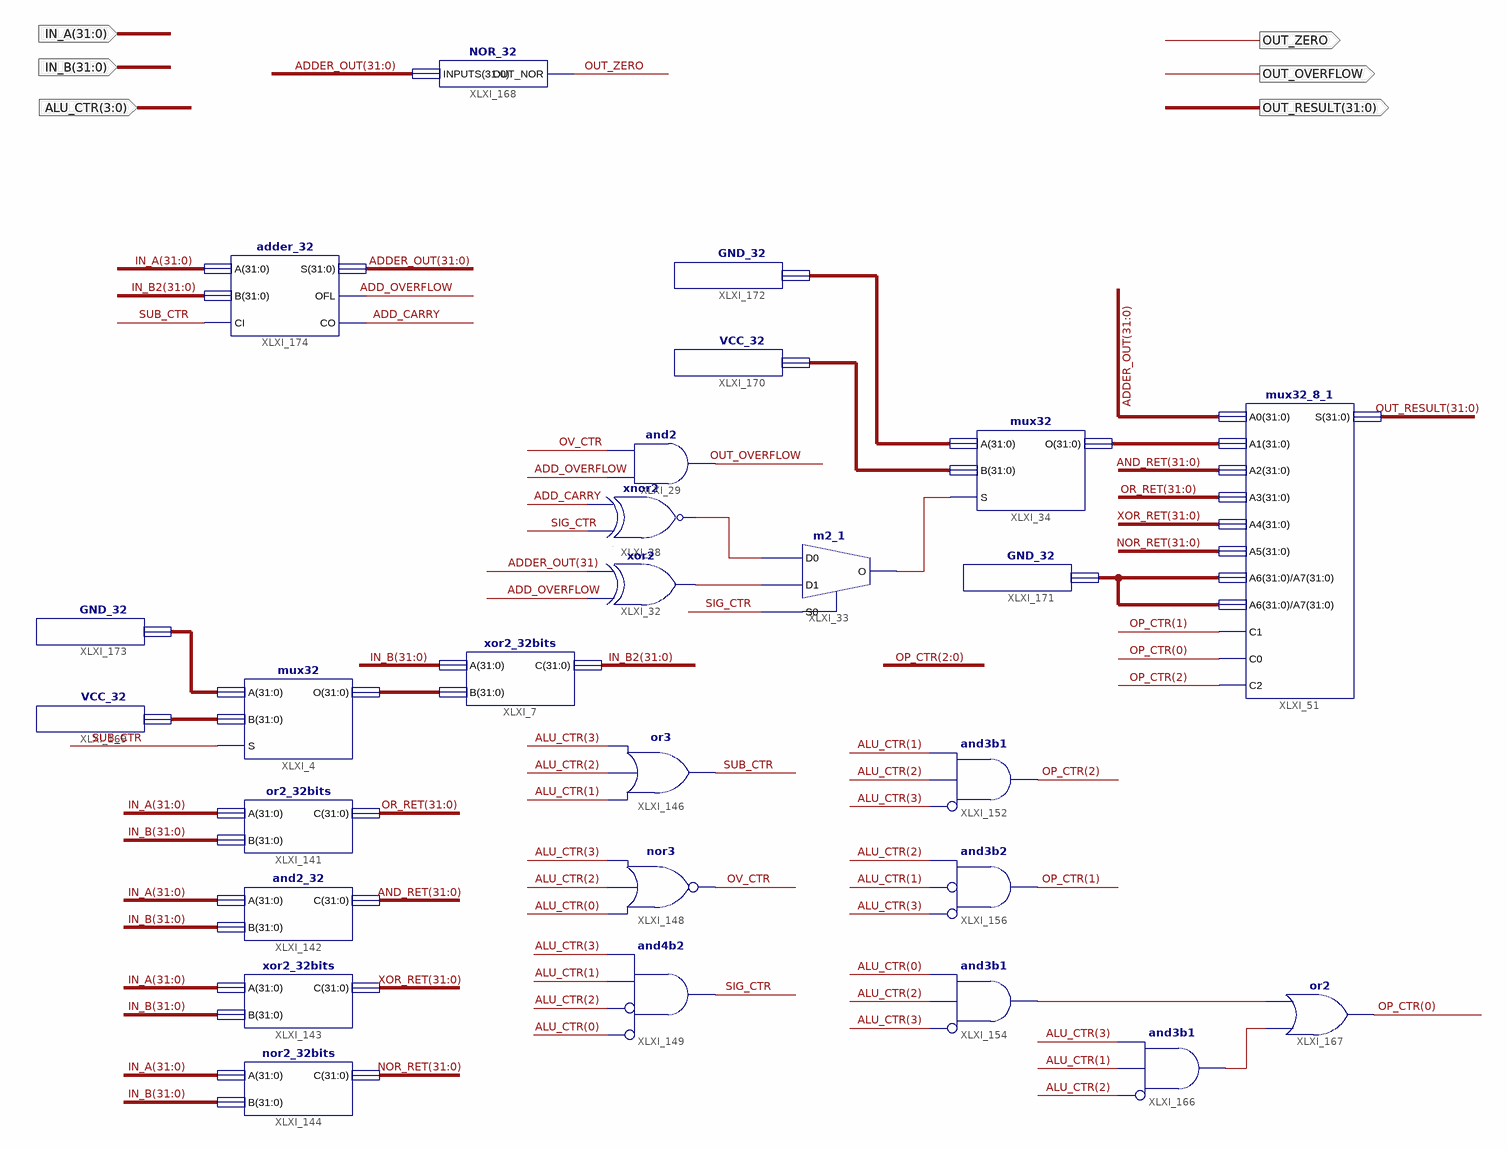
[diagram p0: schematic sheet 1]
// Xilinx ISE schematic ALU.sch (artix7) as structural Verilog: 27 symbols, 6 ports
module ALU (
  input  [31:0] IN_A,
  input  [31:0] IN_B,
  input  [3:0] ALU_CTR,
  output OUT_ZERO,
  output OUT_OVERFLOW,
  output [31:0] OUT_RESULT
);

  wire ADD_CARRY, ADD_OVERFLOW, OV_CTR, SIG_CTR, SUB_CTR, XLXN_25, XLXN_26, XLXN_61, XLXN_348, XLXN_349;
  wire [2:0] OP_CTR;
  wire [31:0] ADDER_OUT, AND_RET, IN_B2, NOR_RET, OR_RET, XLXN_11, XLXN_24, XLXN_62, XLXN_275, XLXN_352,
       XLXN_354, XLXN_355, XOR_RET;

  xnor XLXI_28 (XLXN_25, SIG_CTR, ADD_CARRY);
  and XLXI_29 (OUT_OVERFLOW, ADD_OVERFLOW, OV_CTR);
  xor XLXI_32 (XLXN_26, ADD_OVERFLOW, ADDER_OUT[31]);
  m2_1 XLXI_33 (.D0(XLXN_25), .D1(XLXN_26), .S0(SIG_CTR), .O(XLXN_61));
  mux32 XLXI_34 (.A(XLXN_354), .B(XLXN_352), .S(XLXN_61), .O(XLXN_62));
  mux32_8_1 XLXI_51 (
    .A0(ADDER_OUT), .A1(XLXN_62), .A2(AND_RET), .A3(OR_RET), .A4(XOR_RET), .A5(NOR_RET), .A6(XLXN_275),
    .A7(XLXN_275), .C1(OP_CTR[1]), .C0(OP_CTR[0]), .C2(OP_CTR[2]), .S(OUT_RESULT));
  xor2_32bits XLXI_7 (.A(IN_B), .B(XLXN_24), .C(IN_B2));
  mux32 XLXI_4 (.A(XLXN_355), .B(XLXN_11), .S(SUB_CTR), .O(XLXN_24));
  or2_32bits XLXI_141 (.A(IN_A), .B(IN_B), .C(OR_RET));
  and2_32 XLXI_142 (.A(IN_A), .B(IN_B), .C(AND_RET));
  xor2_32bits XLXI_143 (.A(IN_A), .B(IN_B), .C(XOR_RET));
  nor2_32bits XLXI_144 (.A(IN_A), .B(IN_B), .C(NOR_RET));
  or XLXI_146 (SUB_CTR, ALU_CTR[1], ALU_CTR[2], ALU_CTR[3]);
  nor XLXI_148 (OV_CTR, ALU_CTR[0], ALU_CTR[2], ALU_CTR[3]);
  and XLXI_149 (SIG_CTR, ~ALU_CTR[0], ~ALU_CTR[2], ALU_CTR[1], ALU_CTR[3]);  // and4b2
  and XLXI_152 (OP_CTR[2], ~ALU_CTR[3], ALU_CTR[2], ALU_CTR[1]);  // and3b1
  and XLXI_156 (OP_CTR[1], ~ALU_CTR[3], ~ALU_CTR[1], ALU_CTR[2]);  // and3b2
  and XLXI_154 (XLXN_348, ~ALU_CTR[3], ALU_CTR[2], ALU_CTR[0]);  // and3b1
  and XLXI_166 (XLXN_349, ~ALU_CTR[2], ALU_CTR[1], ALU_CTR[3]);  // and3b1
  or XLXI_167 (OP_CTR[0], XLXN_349, XLXN_348);
  NOR_32 XLXI_168 (.INPUTS(ADDER_OUT), .OUT_NOR(OUT_ZERO));
  VCC_32 XLXI_169 (.VCC_OUT(XLXN_11));
  VCC_32 XLXI_170 (.VCC_OUT(XLXN_352));
  GND_32 XLXI_171 (.GND_OUT(XLXN_275));
  GND_32 XLXI_172 (.GND_OUT(XLXN_354));
  GND_32 XLXI_173 (.GND_OUT(XLXN_355));
  adder_32 XLXI_174 (.A(IN_A), .B(IN_B2), .CI(SUB_CTR), .CO(ADD_CARRY), .OFL(ADD_OVERFLOW), .S(ADDER_OUT));
endmodule
